# Altium schematic sheet InputAnalog.SchDoc
size A4
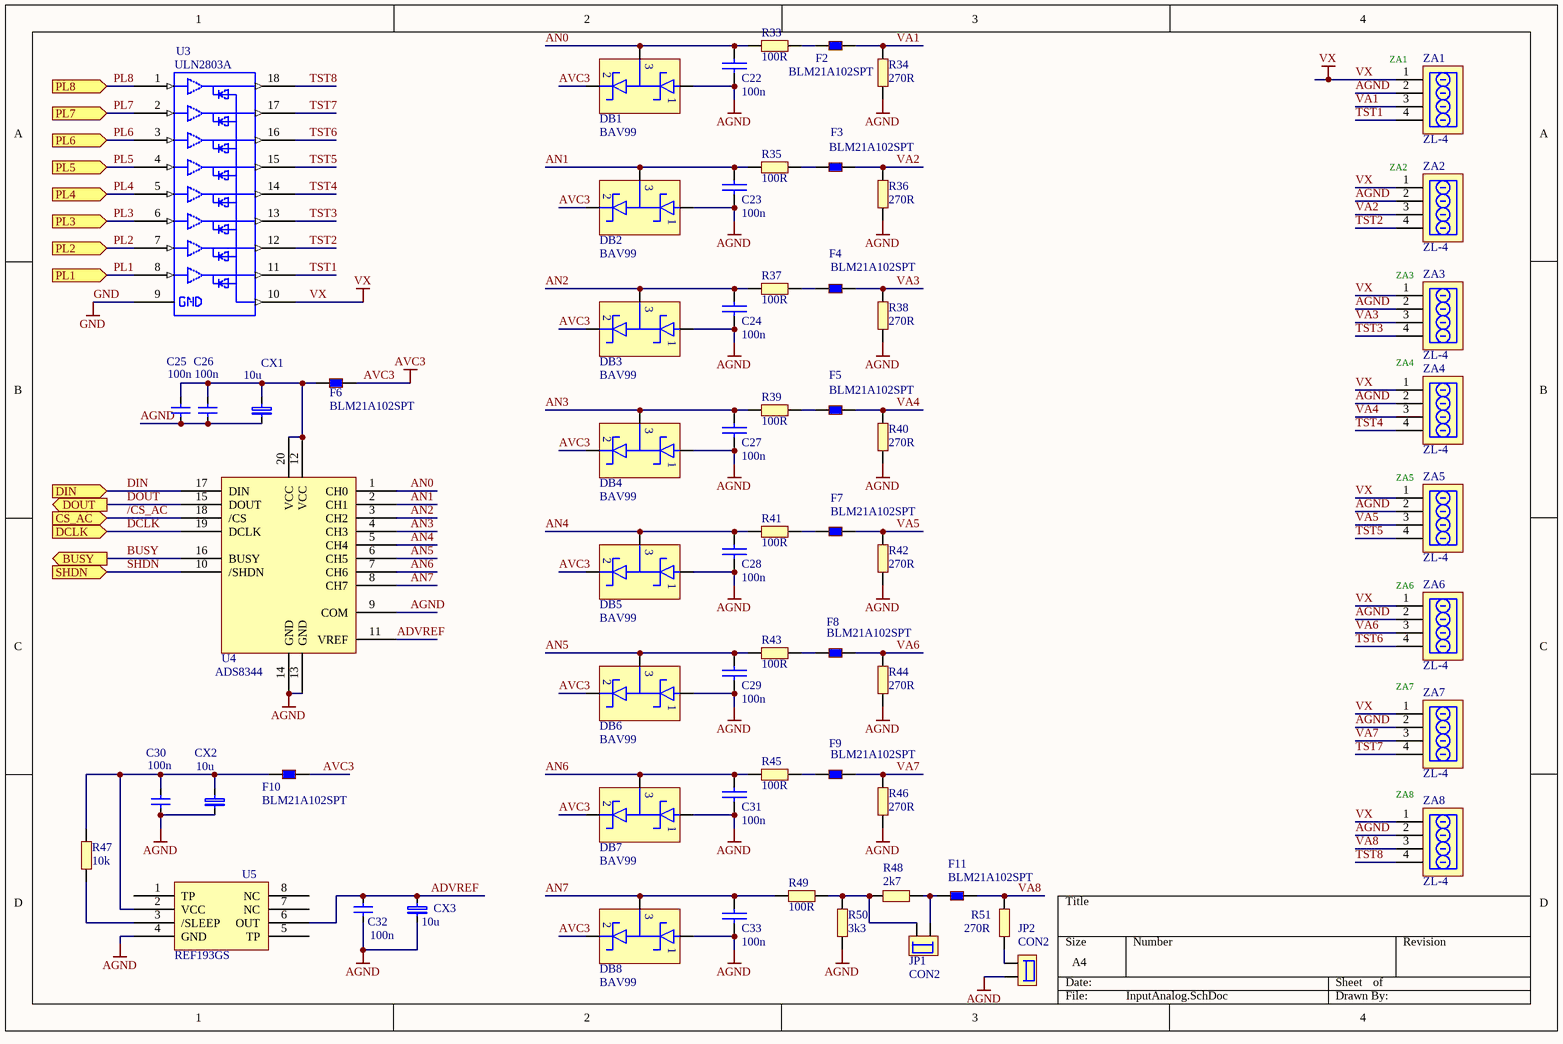
[diagram p0: InputAnalog.SchDoc]

## Parts
C22  100n  [0603C]
C23  100n  [0603C]
C24  100n  [0603C]
C25  100n  [0603C]
C26  100n  [0603C]
C27  100n  [0603C]
C28  100n  [0603C]
C29  100n  [0603C]
C30  100n  [0603C]
C31  100n  [0603C]
C32  100n  [0603C]
C33  100n  [0603C]
CX1  10u  [CAP_A]
CX2  10u  [CAP_A]
CX3  10u  [CAP_A]
DB1  BAV99  [SOT-23]
DB2  BAV99  [SOT-23]
DB3  BAV99  [SOT-23]
DB4  BAV99  [SOT-23]
DB5  BAV99  [SOT-23]
DB6  BAV99  [SOT-23]
DB7  BAV99  [SOT-23]
DB8  BAV99  [SOT-23]
F2  BLM21A102SPT  [0603L]
F3  BLM21A102SPT  [0603L]
F4  BLM21A102SPT  [0603L]
F5  BLM21A102SPT  [0603L]
F6  BLM21A102SPT  [0603L]
F7  BLM21A102SPT  [0603L]
F8  BLM21A102SPT  [0603L]
F9  BLM21A102SPT  [0603L]
F10  BLM21A102SPT  [0603L]
F11  BLM21A102SPT  [0603L]
JP1  CON2  [SIP2]
JP2  CON2  [SIP2]
R33  100R  [0603R]
R34  270R  [0805R]
R35  100R  [0603R]
R36  270R  [0805R]
R37  100R  [0603R]
R38  270R  [0805R]
R39  100R  [0603R]
R40  270R  [0805R]
R41  100R  [0603R]
R42  270R  [0805R]
R43  100R  [0603R]
R44  270R  [0805R]
R45  100R  [0603R]
R46  270R  [0805R]
R47  10k  [0603R]
R48  2k7  [0603R]
R49  100R  [0603R]
R50  3k3  [0603R]
R51  270R  [0805R]
U3  ULN2803A  [SO-18]
U4  ADS8344  [TSSOP20]
U5  REF193GS  [SO8]
ZA1  ZL-4  [ARC-4-3.5-TYCO-2]
ZA2  ZL-4  [ARC-4-3.5-TYCO-2]
ZA3  ZL-4  [ARC-4-3.5-TYCO-2]
ZA4  ZL-4  [ARC-4-3.5-TYCO-2]
ZA5  ZL-4  [ARC-4-3.5-TYCO-2]
ZA6  ZL-4  [ARC-4-3.5-TYCO-2]
ZA7  ZL-4  [ARC-4-3.5-TYCO-2]
ZA8  ZL-4  [ARC-4-3.5-TYCO-2]

## Ports
BUSY (out), CS_AC (in), DCLK (in), DIN (in), DOUT (out), PL1 (in), PL2 (in), PL3 (in), PL4 (in), PL5 (in), PL6 (in), PL7 (in), PL8 (in), SHDN (in)

## Nets
AGND: C22.2 C23.2 C24.2 C25.2 C26.2 C27.2 C28.2 C29.2 C30.2 C31.2 C32.2 C33.2 CX1.1 CX2.1 CX3.1 DB1.1 DB2.1 DB3.1 DB4.1 DB5.1 DB6.1 DB7.1 DB8.1 JP2.2 R34.1 R36.1 R38.1 R40.1 R42.1 R44.1 R46.1 R50.2 U4.9(COM) U4.13(GND) U4.14(GND) U5.4(GND) ZA1.2 ZA2.2 ZA3.2 ZA4.2 ZA5.2 ZA6.2 ZA7.2 ZA8.2
AVC3: DB1.2 DB2.2 DB3.2 DB4.2 DB5.2 DB6.2 DB7.2 DB8.2 F6.2 F10.2
GND: U3.9
VX: U3.10 ZA1.1 ZA2.1 ZA3.1 ZA4.1 ZA5.1 ZA6.1 ZA7.1 ZA8.1
/CS_AC: U4.18(/CS) ; port CS_AC
ADVREF: C32.1 CX3.2 U4.11(VREF) U5.6(OUT)
AN0: C22.1 DB1.3 R33.2 U4.1(CH0)
AN1: C23.1 DB2.3 R35.2 U4.2(CH1)
AN2: C24.1 DB3.3 R37.2 U4.3(CH2)
AN3: C27.1 DB4.3 R39.2 U4.4(CH3)
AN4: C28.1 DB5.3 R41.2 U4.5(CH4)
AN5: C29.1 DB6.3 R43.2 U4.6(CH5)
AN6: C31.1 DB7.3 R45.2 U4.7(CH6)
AN7: C33.1 DB8.3 R49.2 U4.8(CH7)
BUSY: U4.16(BUSY) ; port BUSY
DCLK: U4.19(DCLK) ; port DCLK
DIN: U4.17(DIN) ; port DIN
DOUT: U4.15(DOUT) ; port DOUT
PL1: U3.8 ; port PL1
PL2: U3.7 ; port PL2
PL3: U3.6 ; port PL3
PL4: U3.5 ; port PL4
PL5: U3.4 ; port PL5
PL6: U3.3 ; port PL6
PL7: U3.2 ; port PL7
PL8: U3.1 ; port PL8
SHDN: U4.10(/SHDN) ; port SHDN
TST1: U3.11 ZA1.4
TST2: U3.12 ZA2.4
TST3: U3.13 ZA3.4
TST4: U3.14 ZA4.4
TST5: U3.15 ZA5.4
TST6: U3.16 ZA6.4
TST7: U3.17 ZA7.4
TST8: U3.18 ZA8.4
VA1: F2.2 R34.2 ZA1.3
VA2: F3.2 R36.2 ZA2.3
VA3: F4.2 R38.2 ZA3.3
VA4: F5.2 R40.2 ZA4.3
VA5: F7.2 R42.2 ZA5.3
VA6: F8.2 R44.2 ZA6.3
VA7: F9.2 R46.2 ZA7.3
VA8: F11.2 R51.2 ZA8.3
NetC25_1: C25.1 C26.1 CX1.2 F6.1 U4.12(VCC) U4.20(VCC)
NetC30_1: C30.1 CX2.2 F10.1 R47.1 U5.2(VCC)
NetF2_1: F2.1 R33.1
NetF3_1: F3.1 R35.1
NetF4_1: F4.1 R37.1
NetF5_1: F5.1 R39.1
NetF7_1: F7.1 R41.1
NetF8_1: F8.1 R43.1
NetF9_1: F9.1 R45.1
NetF11_1: F11.1 JP1.1 R48.1
NetJP1_2: JP1.2 R48.2 R49.1 R50.1
NetJP2_1: JP2.1 R51.1
NetR47_2: R47.2 U5.3(/SLEEP)

Not connected (* = marked no-connect by the designer): U5 1(TP) 5(TP) 7(NC) 8(NC)

## Notes on the sheet
- (near ZA1) ZA1
- (near ZA2) ZA2
- (near ZA3) ZA3
- ZA4
- (near ZA5) ZA5
- (near ZA6) ZA6
- ZA7
- ZA8

## Library data of the parts
C22-C24 C27-C29 C31 C33 = CAP: Capacitor
C25 C26 C30 C32 = CAP
CX1-CX3 = CAP_TANTAL_SMD: KONDENSATOR ELEKTROLITYCZNY TANTALOWY SMD
DB1-DB8 = BAS70-04
F2-F11 = KORALIK: Koralik ferrytowy
JP1 JP2 = JUMP2: Connector
R33-R51 = RES3
U3 = Pro31.tmp_ULN2803A_42
U5 = REF19X